# EAGLE design DAU_Kupplung.brd_V1_2 (EAGLE 5.11)
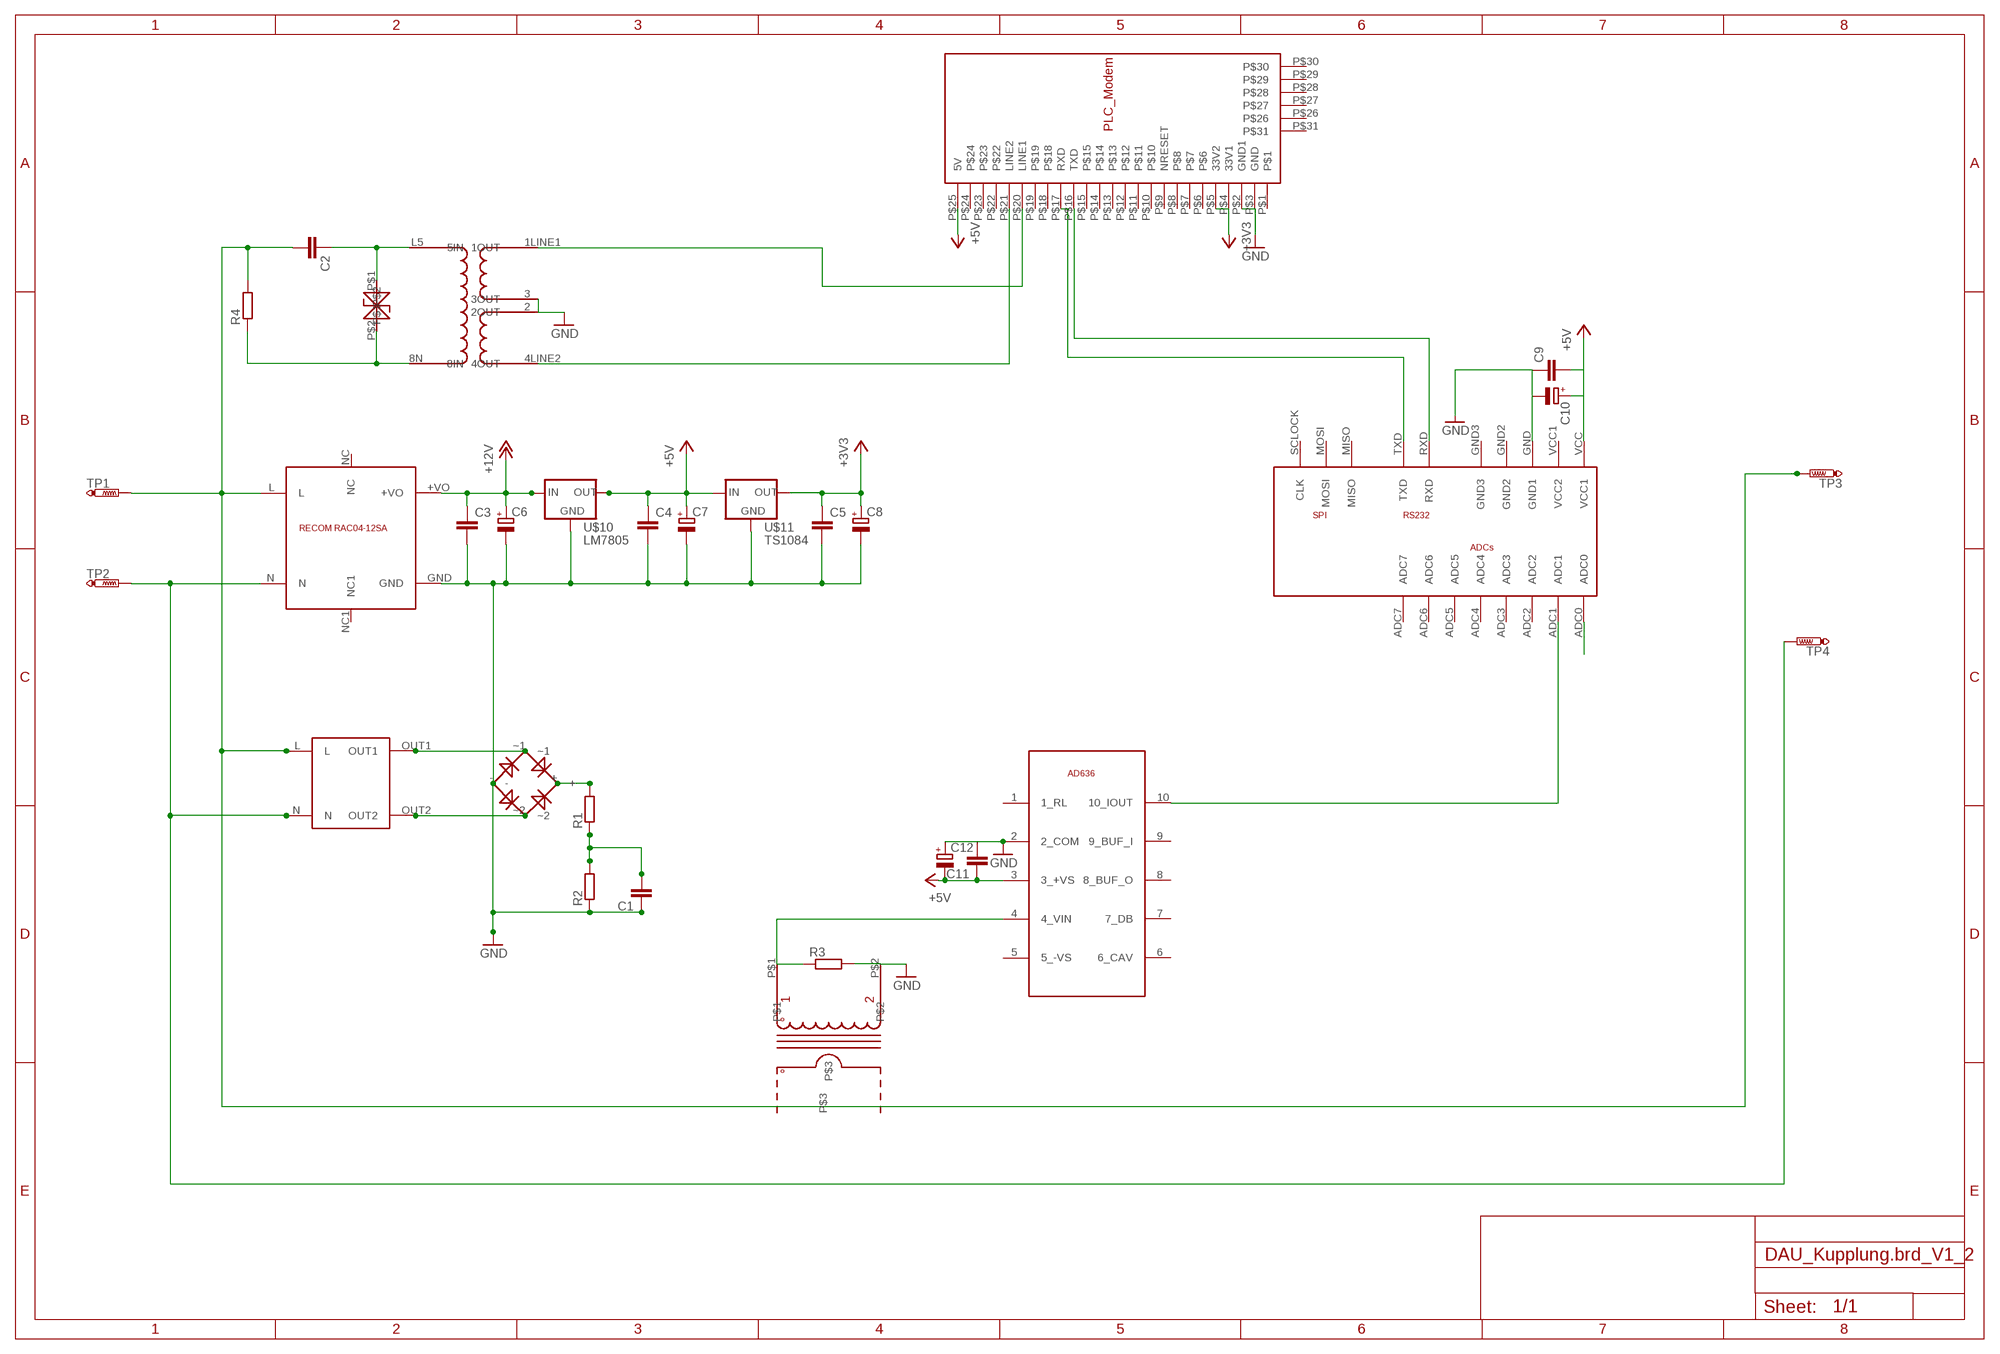
[diagram p0: schematic, sheet 1]

## Parts
C1  C2,5-3  [C2.5-3]
C2  C-EU225-087X268  [C225-087X268]
C3  C-EU025-040X050  [C025-040X050]
C4  C-EU025-040X050  [C025-040X050]
C5  C-EU025-040X050  [C025-040X050]
C6  CPOL-EUE2.5-6  [E2,5-6]
C7  CPOL-EUE2.5-6  [E2,5-6]
C8  CPOL-EUE2.5-6  [E2,5-6]
C9  C-EU025-040X050  [C025-040X050]
C10  CPOL-EUE2,5-6E  [E2,5-6E]
C11  C-EU025-040X050  [C025-040X050]
C12  CPOL-EUE2,5-6E  [E2,5-6E]
R1  R-EU_0204/7  [0204/7]
R2  R-EU_0204/7  [0204/7]
R3  R-EU_0204/7  [0204/7]
R4  R-EU_0204/7  [0204/7]
TP1  PTR1PAD1-17Y  [P1-17Y]
TP2  PTR1PAD1-17Y  [P1-17Y]
TP3  PTR1PAD1-17Y  [P1-17Y]
TP4  PTR1PAD1-17Y  [P1-17Y]
U$1  RECOM_RAC04_12SA  [RAC04_12SA]
U$2  SICHERHEITSTRAFO  [TRAFO_0,35VA]
U$3  ADUC831_MINIMUM  [ADUC_MINIMUM]
U$4  MODEMSTECKER  [MODEM_FUSS]
U$5  PLC_UEBERTRAGER_V2  [PLC-UEBERTRAGER_V2]
U$6  AC1010  [AC1010]
U$7  AD636  [TO100_10PIN]
U$8  RECTIFIER  [RECTIFIER]
U$9  SUPPRESSORDIODE15MM  [DIODE15_5MM]
U$10  LM7805  [LM7805]
U$11  TS1084  [TS1084]

## Nets
+3V3: C5.1 C8.+ U$4.P$4(33V1) U$4.P$5(33V2) U$11.2OUT(OUT)
+5V: C4.1 C7.+ C9.2 C10.+ C11.1 C12.- U$3.VCC(VCC1) U$4.P$25(5V) U$7.3(3_+VS) U$10.OUT U$11.3IN(IN)
+12V: C3.1 C6.+ U$1.+VO U$10.IN
GND: C1.1 C3.2 C4.2 C5.2 C6.- C7.- C8.- C12.+ R2.1 R3.2 U$1.GND U$4.P$2(GND1) U$4.P$3(GND) U$5.2(2OUT) U$5.3(3OUT) U$6.P$2 U$7.2(2_COM) U$8.- U$10.GND U$11.1GND(GND)
N$1: C9.1 U$3.GND(GND1)
N$2: R4.1 U$5.8N(8IN) U$9.P$2
N$3: U$2.OUT1 U$8.~1
N$4: U$2.OUT2 U$8.~2
N$5: U$4.P$20(LINE1) U$5.1LINE1(1OUT)
N$6: C1.2 R1.1 R2.2 U$3.ADC0
N$7: R1.2 U$8.+
N$8: R3.1 U$6.P$1 U$7.4(4_VIN)
N$9: U$3.ADC1 U$7.10(10_IOUT)
N$10: TP2.TP TP4.TP U$1.N U$2.N
N$11: C2.1 U$5.L5(5IN) U$9.P$1
N$12: C2.2 R4.2 TP1.TP TP3.TP U$1.L U$2.L
N$13: U$4.P$21(LINE2) U$5.4LINE2(4OUT)
N$14: U$3.RXD U$4.P$16(TXD)
N$15: U$3.TXD U$4.P$17(RXD)
Unconnected: C10.- C11.2 U$1.NC U$1.NC1 U$3.ADC2 U$3.ADC3 U$3.ADC4 U$3.ADC5 U$3.ADC6 U$3.ADC7 U$3.GND2 U$3.GND3 U$3.MISO U$3.MOSI U$3.SCLOCK(CLK) U$3.VCC1(VCC2) U$4.P$1 U$4.P$6 U$4.P$7 U$4.P$8 U$4.P$9(NRESET) U$4.P$10 U$4.P$11 U$4.P$12 U$4.P$13 U$4.P$14 U$4.P$15 U$4.P$18 U$4.P$19 U$4.P$22 U$4.P$23 U$4.P$24 U$4.P$26 U$4.P$27 U$4.P$28 U$4.P$29 U$4.P$30 U$4.P$31 U$6.P$3 U$7.1(1_RL) U$7.5(5_-VS) U$7.6(6_CAV) U$7.7(7_DB) U$7.8(8_BUF_O) U$7.9(9_BUF_I)

## Library data of the parts
C1 = capacitor-wima:C: CAPACITOR naming: grid - package width
C2-C5 = resistor:C-EU: CAPACITOR, European symbol
C6-C8 = resistor:CPOL-EU: POLARIZED CAPACITOR, European symbol
C9 C11 = rcl:C-EU: CAPACITOR, European symbol
C10 C12 = rcl:CPOL-EU: POLARIZED CAPACITOR, European symbol
R1-R4 = resistor:R-EU_: RESISTOR, European symbol
TP1-TP4 = testpad:PTR1: TEST PIN
U$1 = ADS:RECOM_RAC04_12SA
U$2 = ADS:SICHERHEITSTRAFO
U$3 = ADS_ADUCBoards:ADUC831_MINIMUM
U$4 = ADS:MODEMSTECKER
U$5 = ADS1:PLC_UEBERTRAGER_V2
U$6 = ADS:AC1010
U$7 = ADS:AD636
U$8 = ADS:RECTIFIER
U$9 = ADS:SUPPRESSORDIODE15MM
U$10 = ADS:LM7805
U$11 = ADS1:TS1084

## Board
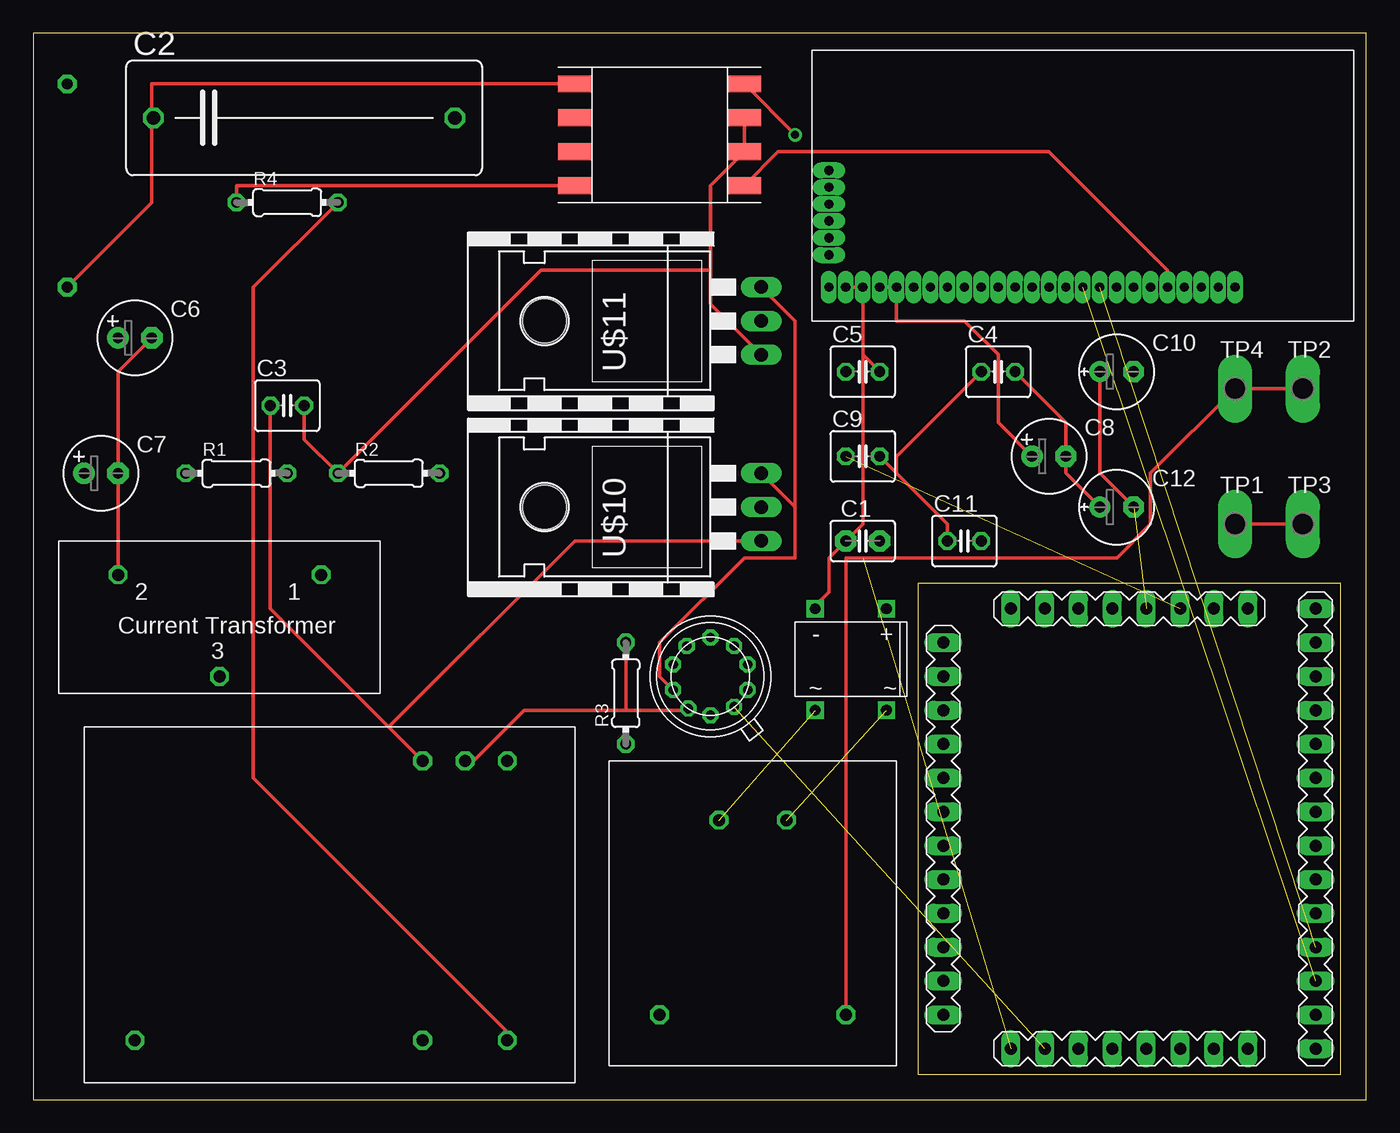
[diagram p1: board, top side]
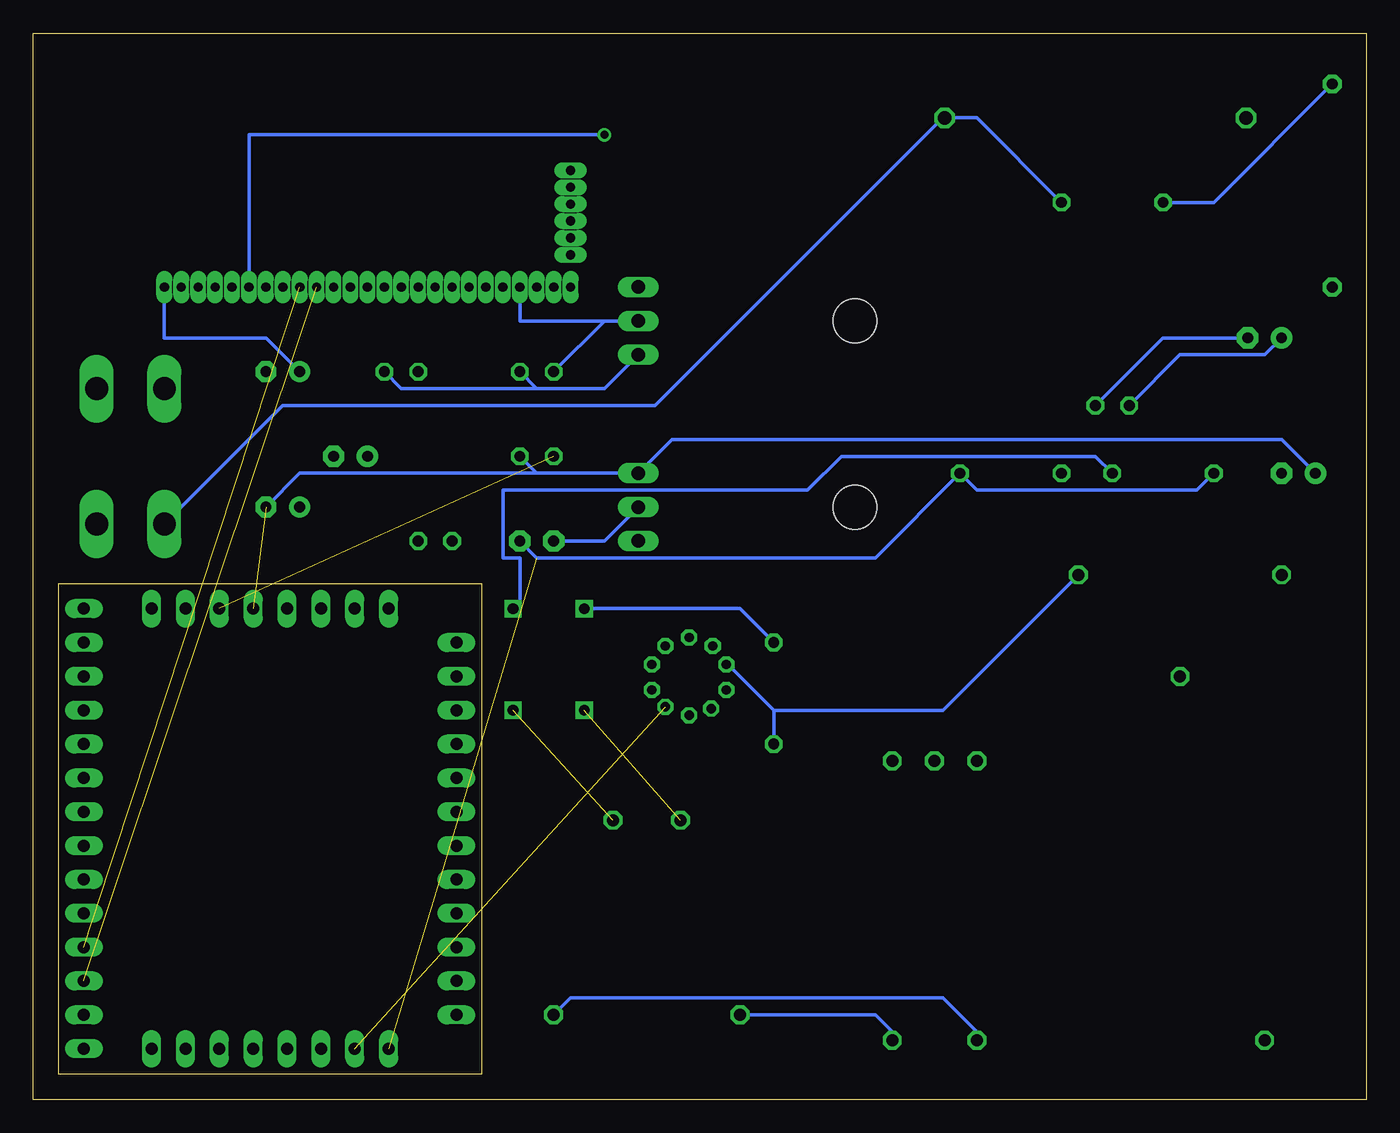
[diagram p2: board, bottom side, seen from below]

Size 100 x 80 mm. Coordinates in mm from the lower left corner, seen from the top.
Outline: 0,0 100,0 100,80 0,80 0,0
Copper layers (1*16): Top 0.035mm / dielectric 1.5mm / Bottom 0.035mm
Design rules "default": minimum track width 10mil, minimum drill 24mil, track to track 8mil, track to pad 8mil, pad to pad 8mil, via to via 8mil, smd to smd 8mil, copper to edge 40mil, drill to drill 8mil, minimum pad ring 10mil, minimum via ring 8mil, stop-mask expansion 4mil, vias tented up to drill 0mil, thermal gap 10mil

### Footprints (pad centres in the part's own frame; a part is rotated, then mirrored left to right if it is on the bottom)
C2.5-3 = drill 0.813 pad 1.6 octagon: 1 -1.27,0; 2 1.27,0
C225-087X268 = drill 1.016 octagon: 1 -11.303,0; 2 11.303,0
C025-040X050 = drill 0.813 octagon: 1 -1.27,0; 2 1.27,0
E2,5-6 = drill 0.813 pad 1.6 round: + -1.27,0 | drill 0.813 pad 1.6 octagon: - 1.27,0
E2,5-6E = drill 0.813 pad 1.575 round: + -1.27,0 | drill 0.813 pad 1.575 octagon: - 1.27,0
0204/7 = drill 0.813 octagon: 1 -3.81,0; 2 3.81,0
P1-17Y = drill 1.702 pad 2.121 long: TP 0,0
RAC04_12SA = drill 0.9 octagon: +VO 25.4,24.13; GND 28.575,24.13; L 31.75,3.175; N 25.4,3.175; NC 3.81,3.175; NC1 31.75,24.13
TRAFO_0,35VA = drill 0.9 octagon: L 3.81,17.78; N 3.81,3.81; OUT1 18.415,13.335; OUT2 18.415,8.255
ADUC_MINIMUM = drill 0.9 long: ADC0 -9.207,-16.51; ADC1 -6.668,-16.51; ADC2 -4.128,-16.51; ADC3 -1.587,-16.51; ADC4 6.032,-16.51; ADC5 8.572,-16.51; ADC6 13.652,-16.51; ADC7 13.652,-13.97; ALE -14.287,6.35; DAC0 0.953,-16.51; DAC1 3.493,-16.51; GND 3.493,16.51; GND2 -4.128,16.51; GND3 -6.668,16.51; INT0 13.652,-6.35; MISO 13.652,-3.81; MOSI 13.652,11.43; P00 -14.287,3.81; P01 -14.287,1.27; P02 -14.287,-1.27; P03 -14.287,-3.81; P04 -14.287,-6.35; P05 -14.287,-8.89; P06 -14.287,-11.43; P07 -14.287,-13.97; P20 13.652,13.97; P21 13.652,16.51; P22 8.572,16.51; P23 6.032,16.51; P24 -9.207,16.51; P25 -14.287,13.97; P34 13.652,-1.27; P35 13.652,1.27; P36 13.652,3.81; P37 13.652,6.35; PWM0 -14.287,11.43; PWM1 -14.287,8.89; RXD 13.652,-11.43; SCLOCK 13.652,8.89; TXD 13.652,-8.89; VCC 0.953,16.51; VCC1 -1.587,16.51
MODEM_FUSS = drill 0.7 pad 0.813 long: P$1 -20.32,-8.89; P$2 -19.05,-8.89; P$3 -17.78,-8.89; P$4 -16.51,-8.89; P$5 -15.24,-8.89; P$6 -13.97,-8.89; P$7 -12.7,-8.89; P$8 -11.43,-8.89; P$9 -10.16,-8.89; P$10 -8.89,-8.89; P$11 -7.62,-8.89; P$12 -6.35,-8.89; P$13 -5.08,-8.89; P$14 -3.81,-8.89; P$15 -2.54,-8.89; P$16 -1.27,-8.89; P$17 0,-8.89; P$18 1.27,-8.89; P$19 2.54,-8.89; P$20 3.81,-8.89; P$21 5.08,-8.89; P$22 6.35,-8.89; P$23 7.62,-8.89; P$24 8.89,-8.89; P$25 10.16,-8.89; P$29 -20.32,-3.937; P$30 -20.32,-5.207; P$31 -20.32,-6.477 | drill 0.7 pad 0.61 long: P$26 -20.32,-0.127; P$27 -20.32,-1.397; P$28 -20.32,-2.667
PLC-UEBERTRAGER_V2 = smd 2.54 x 1.27: 1LINE1 6.35,3.81; 2 6.35,1.27; 3 6.35,-1.27; 4LINE2 6.35,-3.81; 6NC -6.35,1.27; 7NC -6.35,-1.27; 8N -6.35,-3.81; L5 -6.35,3.81
AC1010 = drill 0.9 octagon: P$1 20.32,8.89; P$2 5.08,8.89; P$3 12.7,1.27
TO100_10PIN = drill 0.7 octagon: 1 0,-2.921; 2 -1.651,-2.413; 3 -2.794,-1.016; 4 -2.794,0.889; 5 -1.778,2.286; 6 0,2.921; 7 1.778,2.286; 8 2.794,0.889; 9 2.794,-1.016; 10 1.778,-2.286
RECTIFIER = drill 0.8 square: + 6.858,7.62; - 1.524,7.62; ~1 1.524,0; ~2 6.858,0
DIODE15_5MM = drill 0.8 pad 1.422 octagon: P$1 0,0; P$2 15.24,0
LM7805 = drill 1.016 long: GND 7.62,-3.81; IN 5.08,-3.81; OUT 10.16,-3.81 | hole 3.302: 7.62,12.446
TS1084 = drill 1.016 long: 1GND 5.08,1.27; 2OUT 7.62,1.27; 3IN 10.16,1.27 | hole 3.302: 7.62,17.526

### Placement (x,y rotation side)
C1  62.23,41.91 0 top
C2  20.32,73.66 0 top
C3  19.05,52.07 0 top
C4  72.39,54.61 0 top
C5  62.23,54.61 0 top
C6  7.62,57.15 0 top
C7  5.08,46.99 0 top
C8  76.2,48.26 0 top
C9  62.23,48.26 0 top
C10  81.28,54.61 0 top
C11  69.85,41.91 0 top
C12  81.28,44.45 0 top
R1  15.24,46.99 0 top
R2  26.67,46.99 0 top
R3  44.45,30.48 90 top
R4  19.05,67.31 0 top
TP1  90.17,43.18 0 top
TP2  95.25,53.34 0 top
TP3  95.25,43.18 0 top
TP4  90.17,53.34 0 top
U$1  3.81,1.27 0 top
U$2  64.77,2.54 90 top
U$3  82.55,20.32 0 top
U$4  80.01,69.85 0 top
U$5  46.99,72.39 0 top
U$6  1.27,30.48 0 top
U$7  50.8,31.75 0 top
U$8  57.15,29.21 0 top
U$9  2.54,60.96 90 top
U$10  50.8,36.83 90 top
U$11  55.88,50.8 90 top

### Tracks (layer width: path | path; a pad name or v marks a point on that pad's centre or on a via)
+3V3
  Top 0.254: U$4.P$4 U$4.P$5 64.77,58.42 69.85,58.42 72.39,55.88 72.39,50.8 C8.+
  Bottom 0.254: 57.15,58.42 C5.1 | U$11.2OUT 57.15,58.42 | U$4.P$4 63.5,58.42 57.15,58.42
+5V  (1 unrouted)
  Top 0.254: C12.- 80.01,46.99 C10.+ | 64.77,46.99 68.58,43.18 C11.1 | C9.2 64.77,46.99 | C4.1 64.77,48.26 64.77,46.99 | 57.15,44.45 57.15,40.64 53.34,40.64 46.99,34.29 46.99,31.75 U$7.3 48.26,30.48 | U$10.OUT 57.15,44.45 | U$11.3IN 57.15,58.42 57.15,44.45
  Bottom 0.254: U$4.P$25 90.17,57.15 82.55,57.15 C10.+ | C7.+ 6.35,49.53 52.07,49.53 U$10.OUT 62.23,46.99 | 62.23,46.99 C9.2 | C12.- 80.01,46.99 62.23,46.99
+12V
  Top 0.254: 26.67,27.94 17.78,36.83 C3.1 | U$1.+VO 26.67,27.94 | U$10.IN 40.64,41.91 26.67,27.94
  Bottom 0.254: C3.1 13.97,55.88 7.62,55.88 C6.+
GND
  Top 0.254: C3.2 20.32,49.53 R2.1 38.1,62.23 50.8,62.23 | U$6.P$2 C7.- 6.35,54.61 C6.- | 44.45,29.21 49.53,29.21 U$7.2 | R3.2 44.45,29.21 | 44.45,29.21 36.83,29.21 33.02,25.4 U$1.GND | C4.2 77.47,50.8 C8.- 77.47,46.99 C12.+ | U$8.- 58.42,36.83 59.69,38.1 59.69,40.64 C1.1 62.23,43.18 62.23,55.88 | U$5.2 U$5.3 50.8,68.58 50.8,62.23 | U$4.P$2 U$4.P$3 62.23,55.88 | C5.2 62.23,55.88 | 50.8,62.23 50.8,59.69 U$11.1GND
  Bottom 0.254: C3.2 15.24,57.15 C6.- | U$10.GND 57.15,41.91 C1.1 | U$11.1GND 57.15,53.34 62.23,53.34 | 62.23,53.34 C5.2 | C4.2 72.39,53.34 62.23,53.34 | R3.2 46.99,36.83 U$8.-
N$1  (1 unrouted)
N$2
  Top 0.254: U$5.8N 15.24,68.58 R4.1
  Bottom 0.254: U$9.P$2 11.43,67.31 R4.1
N$3  (1 unrouted)
N$4  (1 unrouted)
N$5  (via drill 0.61)
  Top 0.254: v57.15,72.39 U$5.1LINE1
  Bottom 0.254: U$4.P$20 83.82,72.39 v57.15,72.39
N$6  (1 unrouted)
  Bottom 0.254: R1.1 12.7,45.72 29.21,45.72 R2.2 36.83,40.64 62.23,40.64 C1.2
N$7
  Bottom 0.254: R1.2 20.32,48.26 39.37,48.26 41.91,45.72 64.77,45.72 64.77,40.64 63.5,40.64 63.5,36.83 U$8.+
N$8
  Bottom 0.254: 44.45,29.21 48.26,33.02 U$7.4 | 44.45,29.21 R3.1 | U$6.P$1 31.75,29.21 44.45,29.21
N$9  (1 unrouted)
N$10
  Top 0.254: TP2.TP TP4.TP 83.82,46.99 83.82,43.18 81.28,40.64 60.96,40.64 U$2.N
  Bottom 0.254: U$2.N 59.69,7.62 31.75,7.62 29.21,5.08 U$1.N
N$11
  Top 0.254: U$5.L5 8.89,76.2 8.89,73.66 | U$9.P$1 8.89,67.31 8.89,73.66 | 8.89,73.66 C2.1
N$12
  Top 0.254: TP1.TP TP3.TP | R4.2 16.51,60.96 16.51,24.13 35.56,5.08 U$1.L
  Bottom 0.254: U$2.L 36.83,6.35 35.56,5.08 U$1.L | R4.2 29.21,73.66 C2.2 31.75,73.66 53.34,52.07 81.28,52.07 TP1.TP
N$13
  Top 0.254: U$4.P$21 85.09,62.23 76.2,71.12 55.88,71.12 U$5.4LINE2
N$14  (1 unrouted)
N$15  (1 unrouted)